# Altium schematic sheet 06 SDIO WIFI&BT.SchDoc
size 420 x 297 mm
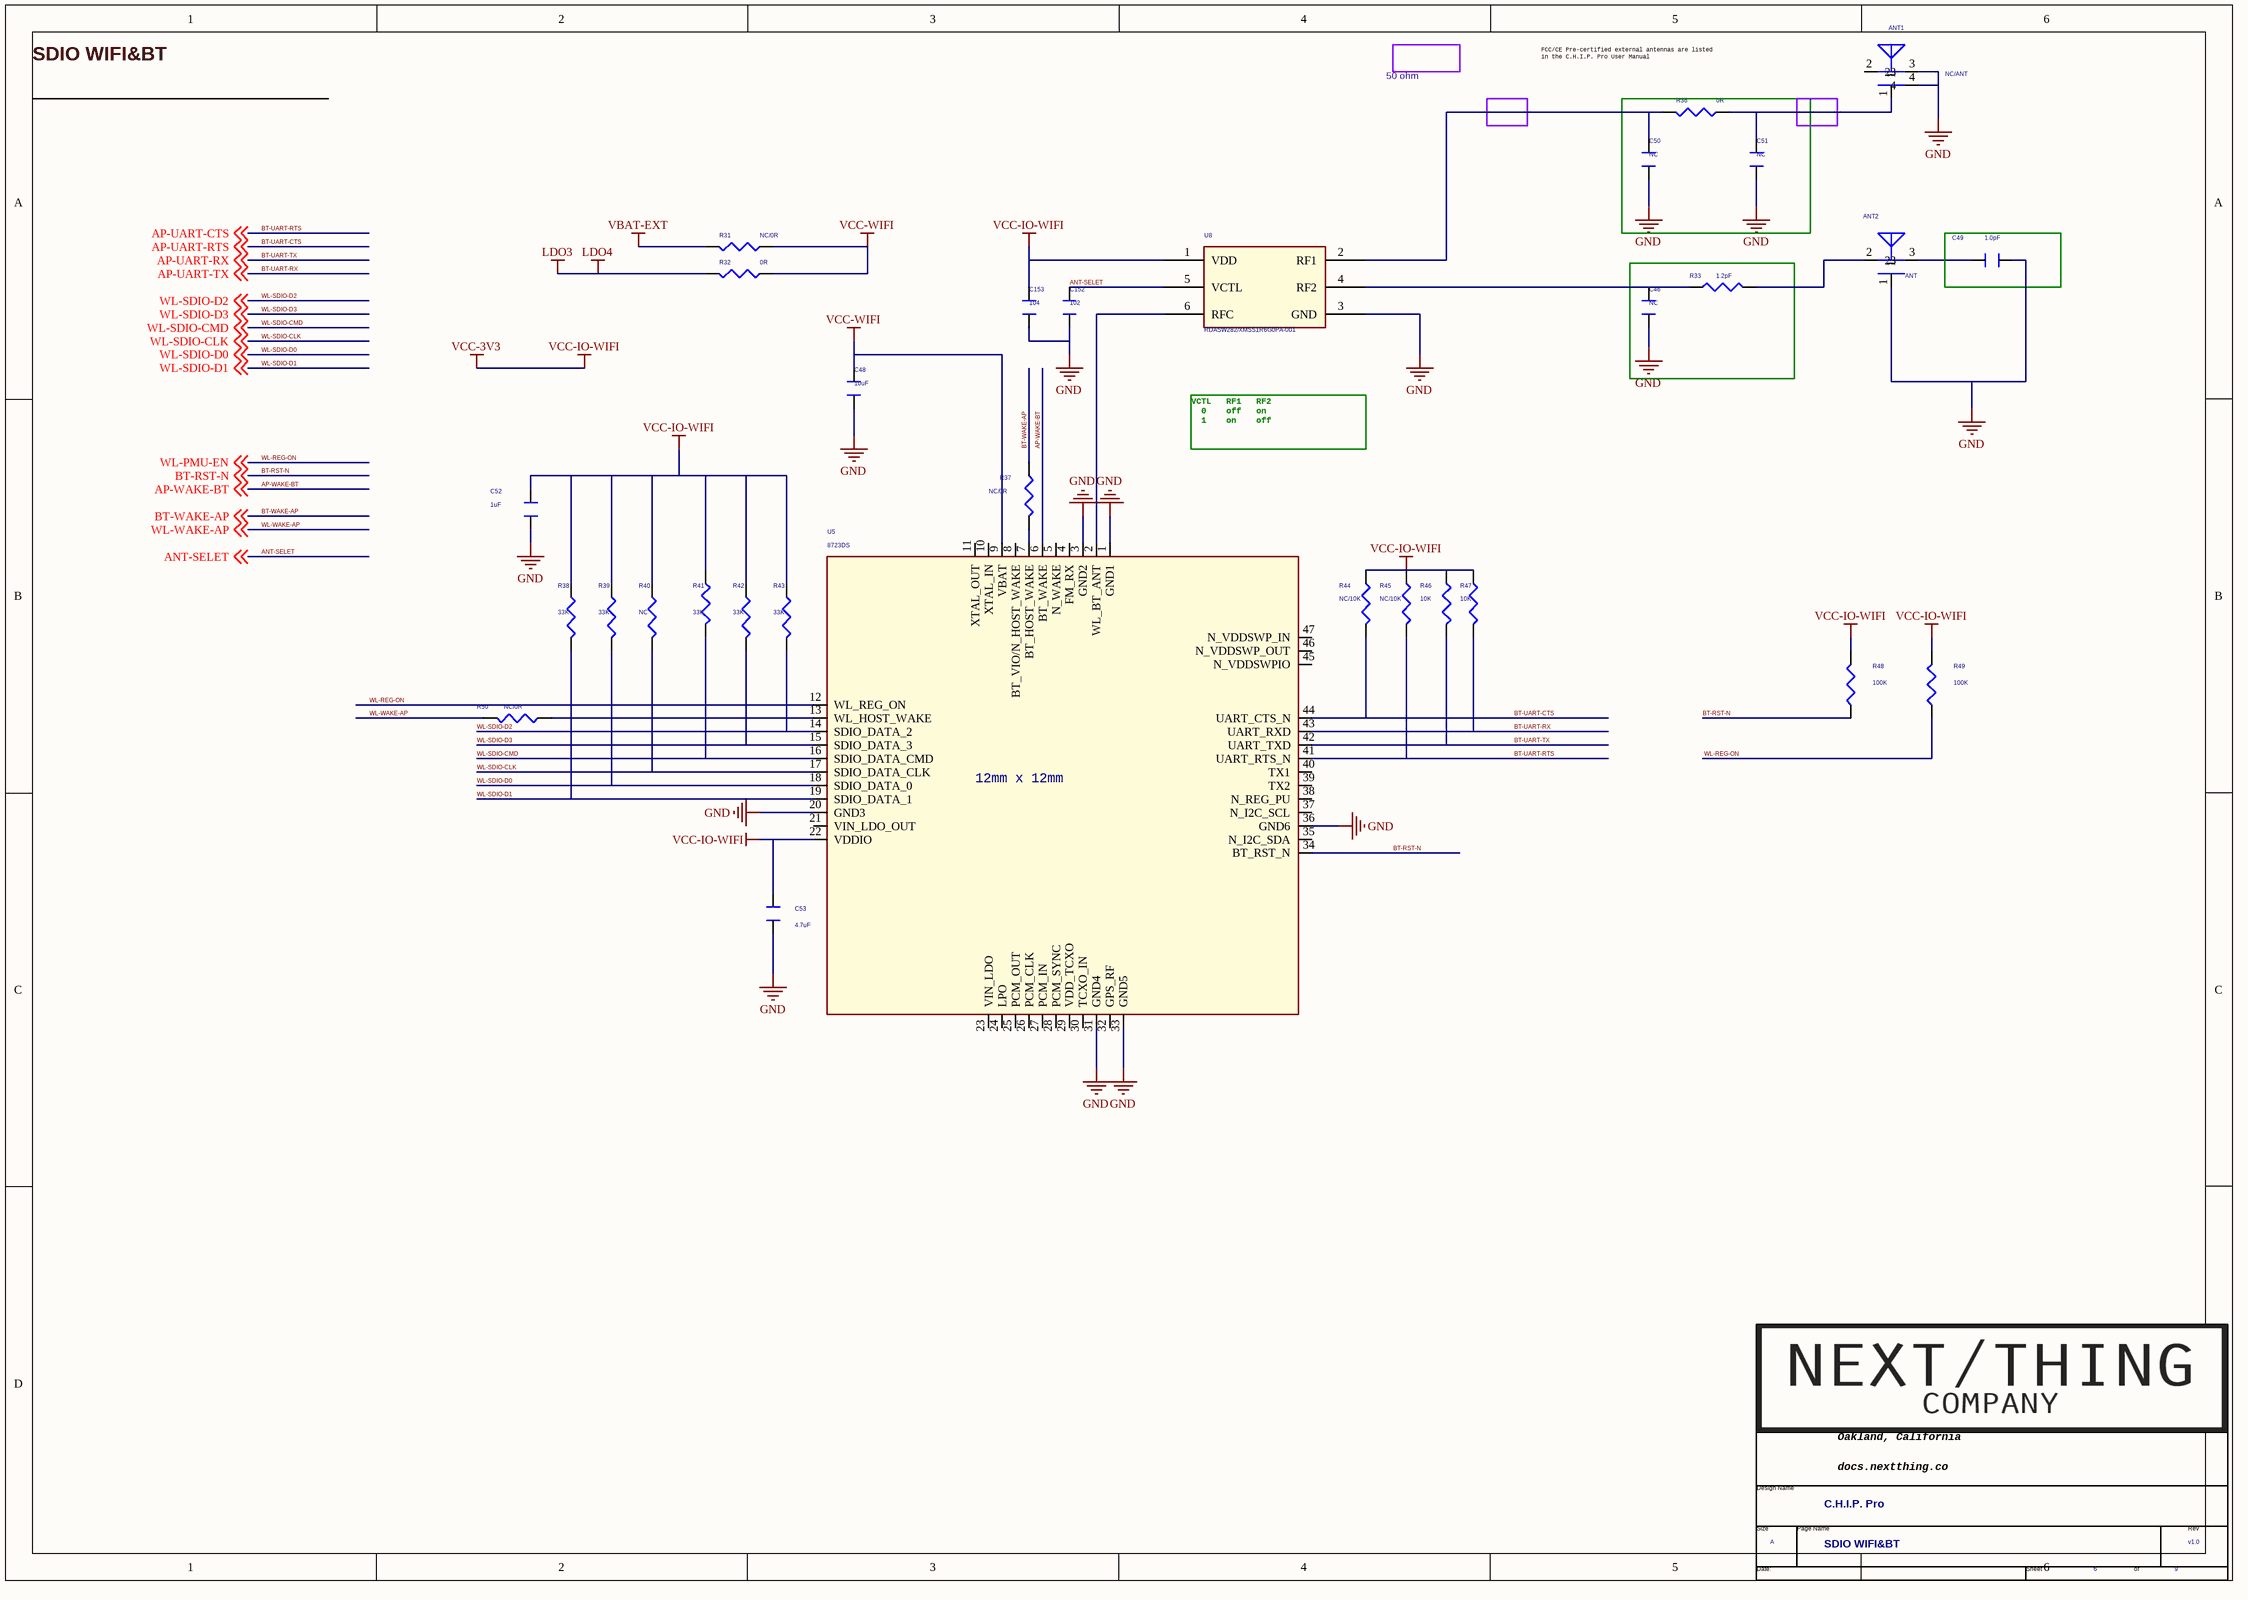
[diagram p0: 06 SDIO WIFI&BT.SchDoc]

## Parts
*  Page Count: 9  Page Number: 6  Page Size: A  Title: C.H.I.P. Pro  RevCode: v1.0  Doc: SDIO WIFI&BT  (hidden comment: TitleBlock1-nextthing)  (graphical)
ANT1  NC/ANT  [WIFI-ANT-SD73412-011H1_3A]
ANT2  ANT  [AA055]
C46  NC  [C0201]
C48  10uF  [C0603]
C49  1.0pF  [C0201]
C50  NC  [C0201]
C51  NC  [C0201]
C52  1uF  [C0402]
C53  4.7uF  [C0603]
C152  102  [C0201]
C153  104  [C0201]
R31  NC/0R  [R0402]
R32  0R  [R0402]
R33  1.2pF  [R0201]
R36  0R  [R0201]
R37  NC/0R  [R0201]
R38  33K  [R0201]
R39  33K  [R0201]
R40  NC  [R0201]
R41  33K  [R0201]
R42  33K  [R0201]
R43  33K  [R0201]
R44  NC/10K  [R0201]
R45  NC/10K  [R0201]
R46  10K  [R0201]
R47  10K  [R0201]
R48  100K  [R0201]
R49  100K  [R0201]
R50  NC/0R  [R0201]
U5  8723DS  [QFN44-AP6476-12X12H1_6A]
U8  RDASW282/XMSS1R6G0PA-001  [RFSW6B105_105H40]

## Nets
GND: ANT1.3 ANT1.4 ANT2.1 C46.2 C48.1 C49.2 C50.2 C51.2 C52.1 C53.2 C152.1 C153.1 U5.1(GND1) U5.3(GND2) U5.20(GND3) U5.31(GND4) U5.33(GND5) U5.36(GND6) U8.3(GND)
LDO3: R32.2  [also labelled LDO4]
VBAT-EXT: R31.2
VCC-3V3: C52.2 C53.1 C153.2 R38.1 R39.1 R40.1 R41.1 R42.1 R43.1 R44.1 R45.1 R46.1 R47.1 R48.2 R49.2 U5.22(VDDIO) U8.1(VDD)  [also labelled VCC-IO-WIFI]
VCC-WIFI: C48.2 R31.1 R32.1 U5.9(VBAT)
ANT-SELET: C152.2 U8.5(VCTL) ; off-sheet ANT-SELET
AP-WAKE-BT: U5.6(BT_WAKE) ; off-sheet AP-WAKE-BT
BT-RST-N: R48.1 U5.34(BT_RST_N) ; off-sheet BT-RST-N
BT-UART-CTS: R44.2 U5.44(UART_CTS_N) ; off-sheet AP-UART-RTS  [also labelled AP-UART-RTS]
BT-UART-RTS: R45.2 U5.41(UART_RTS_N) ; off-sheet AP-UART-CTS  [also labelled AP-UART-CTS]
BT-UART-RX: R47.2 U5.43(UART_RXD) ; off-sheet AP-UART-TX  [also labelled AP-UART-TX]
BT-UART-TX: R46.2 U5.42(UART_TXD) ; off-sheet AP-UART-RX  [also labelled AP-UART-RX]
BT-WAKE-AP: R37.2 ; off-sheet BT-WAKE-AP
WL-REG-ON: R49.1 U5.12(WL_REG_ON) ; off-sheet WL-PMU-EN  [also labelled WL-PMU-EN]
WL-SDIO-CLK: R40.2 U5.17(SDIO_DATA_CLK) ; off-sheet WL-SDIO-CLK
WL-SDIO-CMD: R41.2 U5.16(SDIO_DATA_CMD) ; off-sheet WL-SDIO-CMD
WL-SDIO-D0: R39.2 U5.18(SDIO_DATA_0) ; off-sheet WL-SDIO-D0
WL-SDIO-D1: R38.2 U5.19(SDIO_DATA_1) ; off-sheet WL-SDIO-D1
WL-SDIO-D2: R43.2 U5.14(SDIO_DATA_2) ; off-sheet WL-SDIO-D2
WL-SDIO-D3: R42.2 U5.15(SDIO_DATA_3) ; off-sheet WL-SDIO-D3
WL-WAKE-AP: R50.2 ; off-sheet WL-WAKE-AP
NetANT1_1: ANT1.1 C51.1 R36.1
NetANT2_2: ANT2.2 R33.2
NetANT2_3: ANT2.3 C49.1
NetC46_1: C46.1 R33.1 U8.4(RF2)
NetC50_1: C50.1 R36.2 U8.2(RF1)
NetR37_1: R37.1 U5.7(BT_HOST_WAKE)
NetR50_1: R50.1 U5.13(WL_HOST_WAKE)
NetU5_2: U5.2(WL_BT_ANT) U8.6(RFC)

Not connected (* = marked no-connect by the designer): ANT1 2; U5 4(FM_RX) 5(N_WAKE) 8(BT_VIO/N_HOST_WAKE) 10(XTAL_IN) 11(XTAL_OUT) 21(VIN_LDO_OUT) 23(VIN_LDO) 24(LPO) 25(PCM_OUT) 26(PCM_CLK) 27(PCM_IN) 28(PCM_SYNC) 29(VDD_TCXO) 30(TCXO_IN) 32(GPS_RF) 35(N_I2C_SDA) 37(N_I2C_SCL) 38(N_REG_PU) 39(TX2) 40(TX1) 45(N_VDDSWPIO) 46(N_VDDSWP_OUT) 47(N_VDDSWP_IN)

## Notes on the sheet
- (near ANT1) FCC/CE Pre-certified external antennas are listed
  in the C.H.I.P. Pro User Manual
- SDIO WIFI&BT
- 50 ohm
- VCTL   RF1   RF2
  0    off   on
  1    on    off
- (in symbol AP6493_4) 12mm x 12mm
- (in symbol TitleBlock1-nextthing) Oakland, California; Design Name; docs.nextthing.co /; Size; Page Name; Rev; Date:; Sheet; of

## Library data of the parts
ANT1 = ANT_4
ANT2 = ANT_2
C46 C48-C53 C152 C153 = CAPACITOR_0_Dup4: PAGE: 2
R31-R33 R36-R50 = R_Dup1
U5 = AP6493_4: Device: AMPAK_SIP; QVL: AMPAK; ORCAD_LIB: MODULE
U8 = SP2T
* = TitleBlock1-nextthing: Page Create Date: March  8, 1995